# EAGLE design pc_fdc1004_brk (EAGLE 6.4)
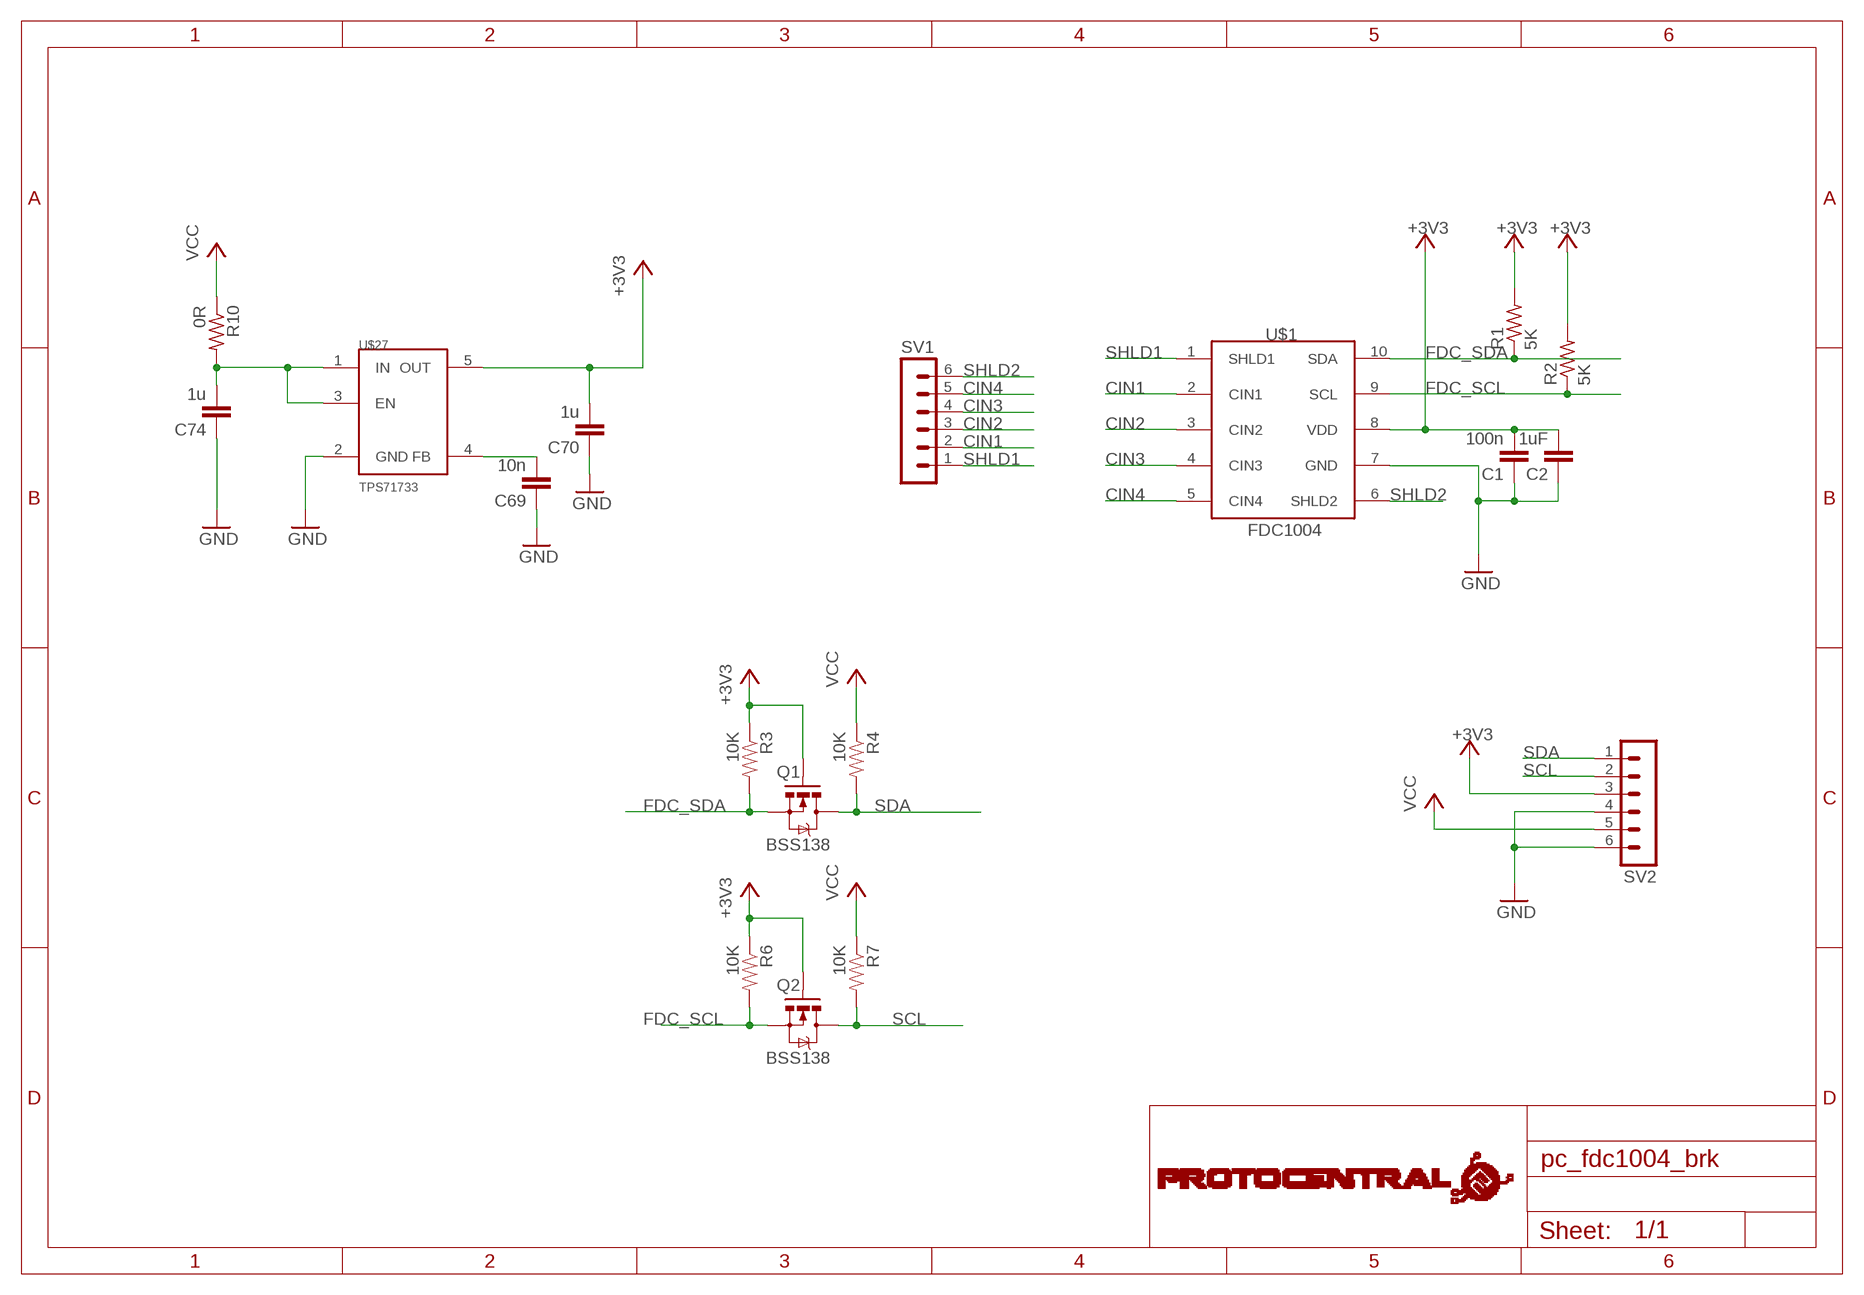
[diagram p0: schematic, sheet 1]

## Parts
C1  100n  C-EUC0805  [C0805]
C2  1uF  C-EUC0805  [C0805]
C69  10n  C-EUC0805  [C0805]
C70  1u  C-EUC0805  [C0805]
C74  1u  C-EUC0805  [C0805]
Q1  BSS138  MOSFET-NCHANNELSMD  [SOT23-3]
Q2  BSS138  MOSFET-NCHANNELSMD  [SOT23-3]
R1  5K  R-US_R0805  [R0805]
R2  5K  R-US_R0805  [R0805]
R3  10K  RESISTOR0603-RES  [0603-RES]
R4  10K  RESISTOR0603-RES  [0603-RES]
R6  10K  RESISTOR0603-RES  [0603-RES]
R7  10K  RESISTOR0603-RES  [0603-RES]
R10  0R  R-US_R0805  [R0805]
SV1  MA06-1  [MA06-1]
SV2  MA06-1  [MA06-1]
U$1  FDC1004  [VSSOP-10]
U$6  PROTY_LOGO_WITH_TEXT  [PROTY_WITH_TEXT]
U$27  TPS71733  TPS717XX  [SC70-5]

## Nets
+3V3: C1.2 C2.2 C70.2 Q1.1(G) Q2.1(G) R1.2 R2.2 R3.1 R6.1 SV2.3 U$1.8(VDD) U$27.5(OUT)
CIN1: SV1.2 U$1.2(CIN1)
CIN2: SV1.3 U$1.3(CIN2)
CIN3: SV1.4 U$1.4(CIN3)
CIN4: SV1.5 U$1.5(CIN4)
FDC_SCL: Q2.2(S) R2.1 R6.2 U$1.9(SCL)
FDC_SDA: Q1.2(S) R1.1 R3.2 U$1.10(SDA)
GND [gnd]: C1.1 C2.1 C69.1 C70.1 C74.1 SV2.4 SV2.6 U$1.7(GND) U$27.2(GND)
N$2: C74.2 R10.2 U$27.1(IN) U$27.3(EN)
N$70: C69.2 U$27.4(FB)
SCL: Q2.3(D) R7.2 SV2.2
SDA: Q1.3(D) R4.2 SV2.1
SHLD1: SV1.1 U$1.1(SHLD1)
SHLD2: SV1.6 U$1.6(SHLD2)
VCC: R4.1 R7.1 R10.1 SV2.5

## Library data of the parts
C1 C2 C69 C70 C74 = rcl:C-EU: CAPACITOR, European symbol
Q1 Q2 = SparkFun:MOSFET-NCHANNEL
R1 R2 R10 = rcl:R-US_: RESISTOR, American symbol
R3 R4 R6 R7 = SparkFun:RESISTOR: Resistor Basic schematic elements and footprints for 0603, 1206, and PTH resistors.
SV1 SV2 = con-lstb:MA06-1: PIN HEADER; OC_FARNELL: unknown; OC_NEWARK: unknown
U$1 = circuitects:FDC1004
U$6 = circuitects:PROTY_LOGO_WITH_TEXT
U$27 = circuitects:TPS717XX

## Net classes
1 USB: width 0.102 mm, drill 0.1 mm
2 gnd: width 0.102 mm, drill 0.1 mm
3 usbvcc: width 0.102 mm, drill 0.1 mm, clearance 0.15 mm
4 USBpair: width 0.102 mm, drill 0.1 mm, clearance 0.15 mm to class 3

## Board
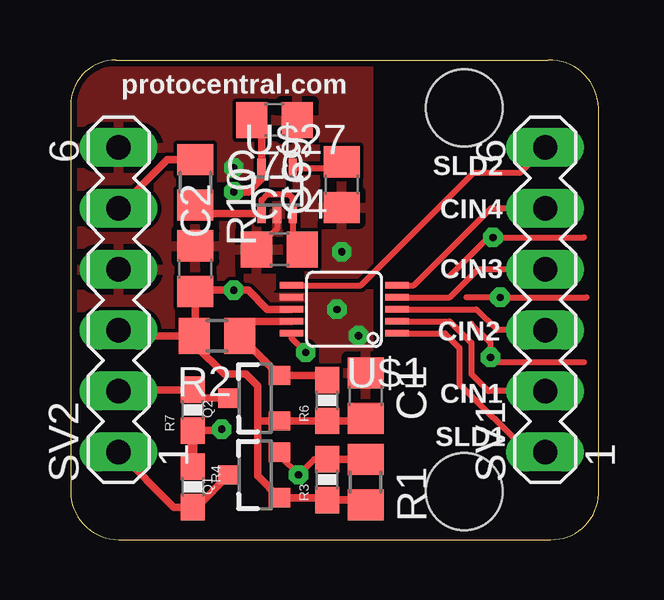
[diagram p1: board, top side]
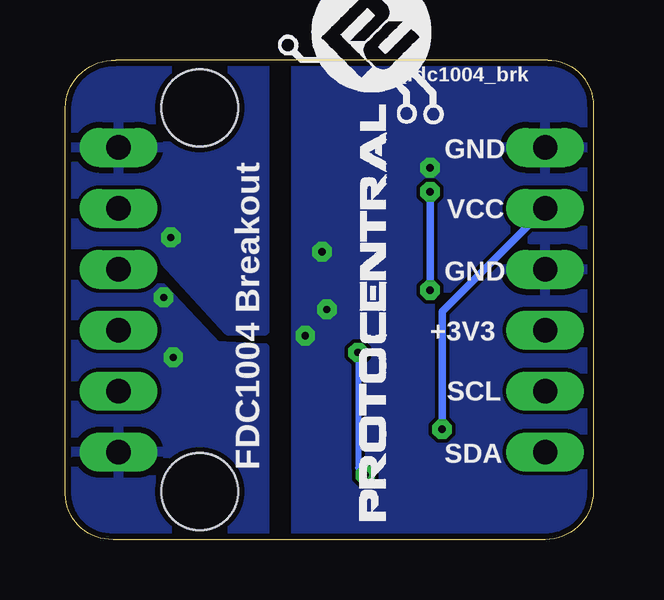
[diagram p2: board, bottom side, seen from below]

Size 22 x 20 mm. Coordinates in mm from the lower left corner, seen from the top.
Outline: 2,0 20,0 arc90 22,1.9 22,18 arc90 19.9,20 1.9,20 arc90 0,18.1 0,2 arc90 2,0
Copper layers (1*2*15*16): Top 0.035mm / dielectric 1.5mm / Route2 0.035mm / dielectric 0.15mm / Route15 0.035mm / dielectric 0.2mm / Bottom 0.035mm
Design rules "Circuitects-Rules": minimum track width 6mil, minimum drill 0.3mm, track to track 6mil, track to pad 6mil, pad to pad 6mil, via to via 6mil, smd to smd 6mil, copper to edge 10mil, drill to drill 8mil, minimum pad ring 12mil, minimum via ring 10mil, stop-mask expansion 4mil, vias tented up to drill 25mil, thermal gap 10mil
Holes 3.2 mm at 16.4,2 16.4,18

### Footprints (pad centres in the part's own frame; a part is rotated, then mirrored left to right if it is on the bottom)
C0805 = smd 1.3 x 1.5: 1 -0.95,0; 2 0.95,0
SOT23-3 = smd 0.8 x 0.9: 1 -0.95,-1; 2 0.95,-1; 3 0,1.1
R0805 = smd 1.3 x 1.5: 1 -0.95,0; 2 0.95,0
0603-RES = smd 1.1 x 1: 1 -0.85,0; 2 0.85,0
MA06-1 = drill 1.016 long: 1 -6.35,0; 2 -3.81,0; 3 -1.27,0; 4 1.27,0; 5 3.81,0; 6 6.35,0
VSSOP-10 = smd 0.27 x 0.975: 1 -1,-2.2; 2 -0.5,-2.2; 3 0,-2.2; 4 0.5,-2.2; 5 1,-2.2; 6 1,2.2; 7 0.5,2.2; 8 0,2.2; 9 -0.5,2.2; 10 -1,2.2
SC70-5 = smd 0.35 x 0.8: 1 -0.65,-0.95; 2 0,-0.95; 3 0.65,-0.95; 4 0.65,0.95; 5 -0.65,0.95

### Placement (x,y rotation side)
C1  12.3,6 270 top
C2  5.2,11.3 270 top
C69  11.3,14.8 90 top
C70  8.5,17.5 180 top
C74  8.7,12.1 0 top
Q1  7.7,2.7 90 top
Q2  7.7,5.9 90 top
R1  12.3,2.4 270 top
R2  6.1,8.5 180 top
R3  10.7,2.5 90 top
R4  5.1,2.2 270 top
R6  10.7,5.8 90 top
R7  5.1,5.4 90 top
R10  5.2,14.9 270 top
SV1  19.78,10 90 top
SV2  2,10 90 top
U$1  11.4,9.6 90 top
U$6  6.6,0.8 90 bottom
U$27  8.61,14.54 0 top

### Tracks (layer width: path | path; a pad name or v marks a point on that pad's centre or on a via)
+3V3  (via drill 0.3)
  Top 0.305: C70.2 7.96,17.09 U$27.5 7.96,15.06 7.4,14.5 v6.8,14.5 | C2.2 5.2,8.55 | 5.2,8.55 R2.2 2.23,8.5 SV2.3 | U$1.8 8.2,9.6 7.4,10.4 v6.8,10.4 5.25,10.4 C2.2 | 5.45,10.1 C2.2 | Q1.1 10.3,1.75 R3.1 12.1,1.65 R1.2 | 8.65,1.8 Q1.1 | 5.2,8.55 5.2,8.1 6.4,6.9 7.3,6.9 7.8,6.4 7.8,4.9 | 7.8,4.9 7.8,2.65 Q1.1 | 7.8,4.9 7.85,4.95 Q2.1 R6.1 12.2,4.95 C1.2
  Bottom 0.305: v6.8,14.5 v6.8,10.4
CIN1
  Top 0.254: U$1.2 15.8,9.1 16.7,8.2 16.7,6.9 17.41,6.19 SV1.2
CIN2
  Top 0.254: U$1.3 16.9,9.6 17.77,8.73 SV1.3
CIN3
  Top 0.254: U$1.4 15.8,10.1 16.97,11.27 SV1.4
CIN4
  Top 0.254: SV1.5 17.51,13.81 14.3,10.6 U$1.5
FDC_SCL
  Top 0.305: U$1.9 7.65,9.1 R2.1 Q2.2 10.2,6.85 R6.2
FDC_SDA  (via drill 0.3)
  Top 0.254: U$1.10 9.2,8.4 v9.8,7.8 | R3.2 10.15,3.35 v9.5,2.7 8.7,3.5 Q1.2
  Top 0.305: R3.2 R1.1
  Bottom 0.254: v9.8,7.8 9.8,3 v9.5,2.7
GND  (via drill 0.3)
  Top 0.254: U$27.2 8.61,12.96 C74.1
  other vias: 11.1,9.6 12,8.5 11.3,12 6.8,15.5
  pour Bottom: 0,0 0,20 12.4,20 12.4,0
  pour Top: 0,0 0,20 12.4,20 12.4,0
N$2
  Top 0.254: U$27.1 7.96,14.16 8.2,14.4 9.1,14.4 9.26,14.24 U$27.3 9.26,12.49 C74.2
  Top 0.305: U$27.1 5.56,13.59 R10.2
N$70
  Top 0.254: U$27.4 11.04,15.49 C69.2
SCL
  Top 0.305: Q2.3 5.45,5.9 R7.2 2.06,6.25 SV2.2
SDA
  Top 0.305: Q1.3 5.25,1.35 R4.2 4.3,1.35 SV2.1
SHLD1  (via drill 0.3)
  Top 0.254: U$1.1 15.6,8.6 16.2,8 16.2,6.5 19.05,3.65 SV1.1 | 16.7,9 17.5,8.2 v17.5,7.6 17.7,7.4 21.4,7.4 | 16.5,10.1 v17.9,10.1 21.5,10.1
  pour Bottom: 13.7,8 13.7,0 22,0 22,11.5 18.9,11.5 15.7,8.1
SHLD2  (via drill 0.3)
  Top 0.254: U$1.6 12.1,10.6 16.8,15.3 18.73,15.3 SV1.6 | 15.8,11 17.4,12.6 v17.6,12.6 21.4,12.6
  pour Bottom: 13.7,8.7 15.2,8.7 18.5,12.3 22,12.3 22,20 13.7,20
VCC  (via drill 0.3)
  Top 0.305: R7.1 6.25,4.55 v6.3,4.6 | R10.1 4.04,15.85 SV2.5
  Top 0.406: R4.1 R7.1
  Bottom 0.305: v6.3,4.6 6.3,9.51 SV2.5

### Text on the board
tPlace: protocentral.com | SLD2 | CIN4 | CIN3 | CIN2 | CIN1 | SLD1
bPlace: pc_fdc1004_brk | GND | VCC | GND | +3V3 | SCL | SDA | FDC1004 Breakout